# Altium schematic sheet Schematic.SchDoc
size 635 x 381 mm; SheetNumber: 1; SheetTotal: 1
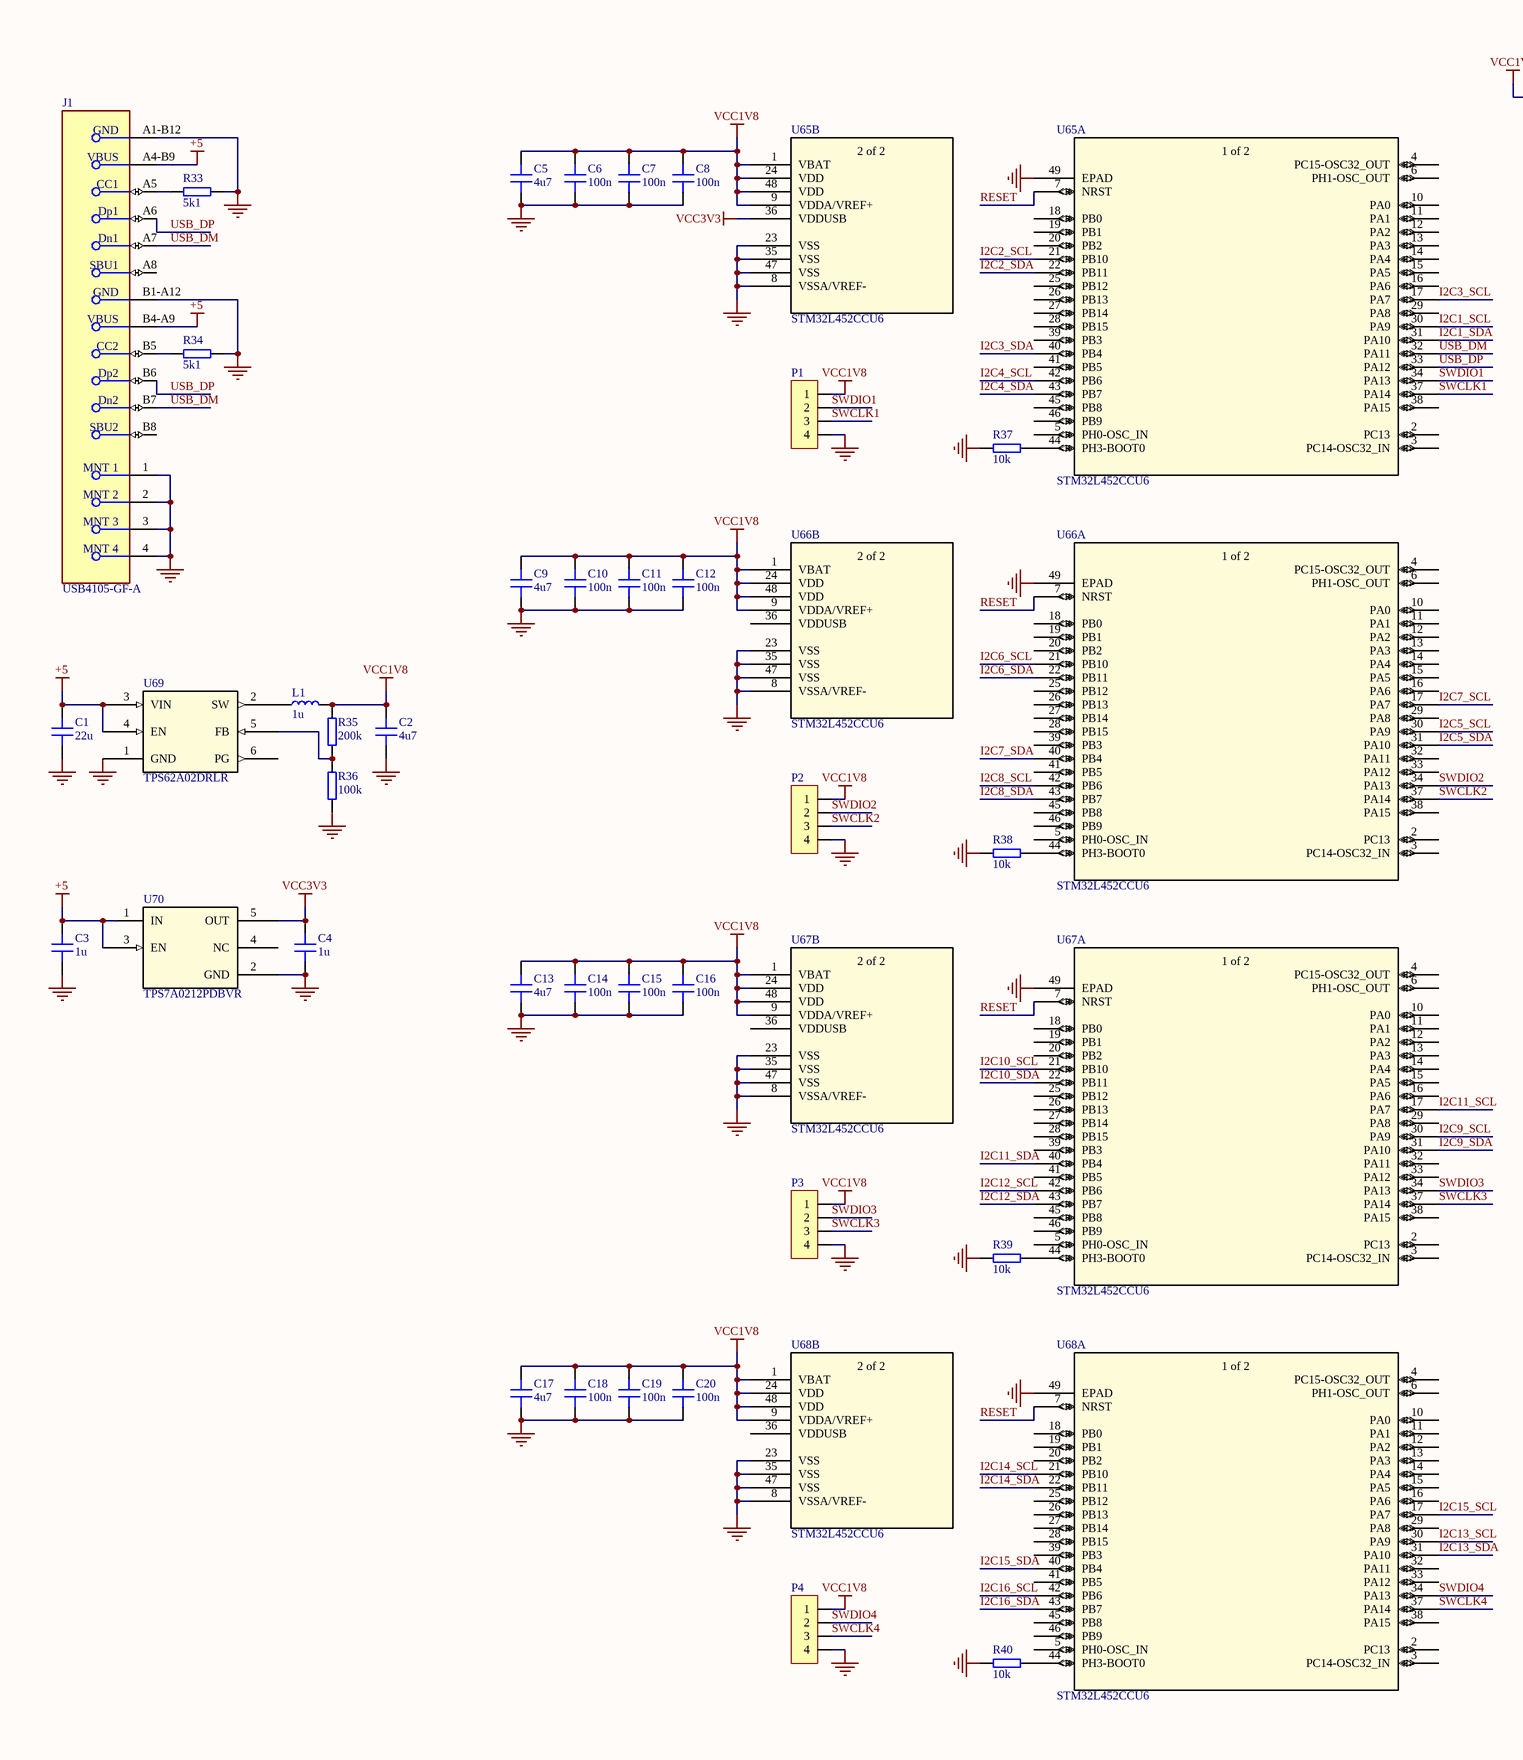
[diagram p0: Schematic.SchDoc, left]
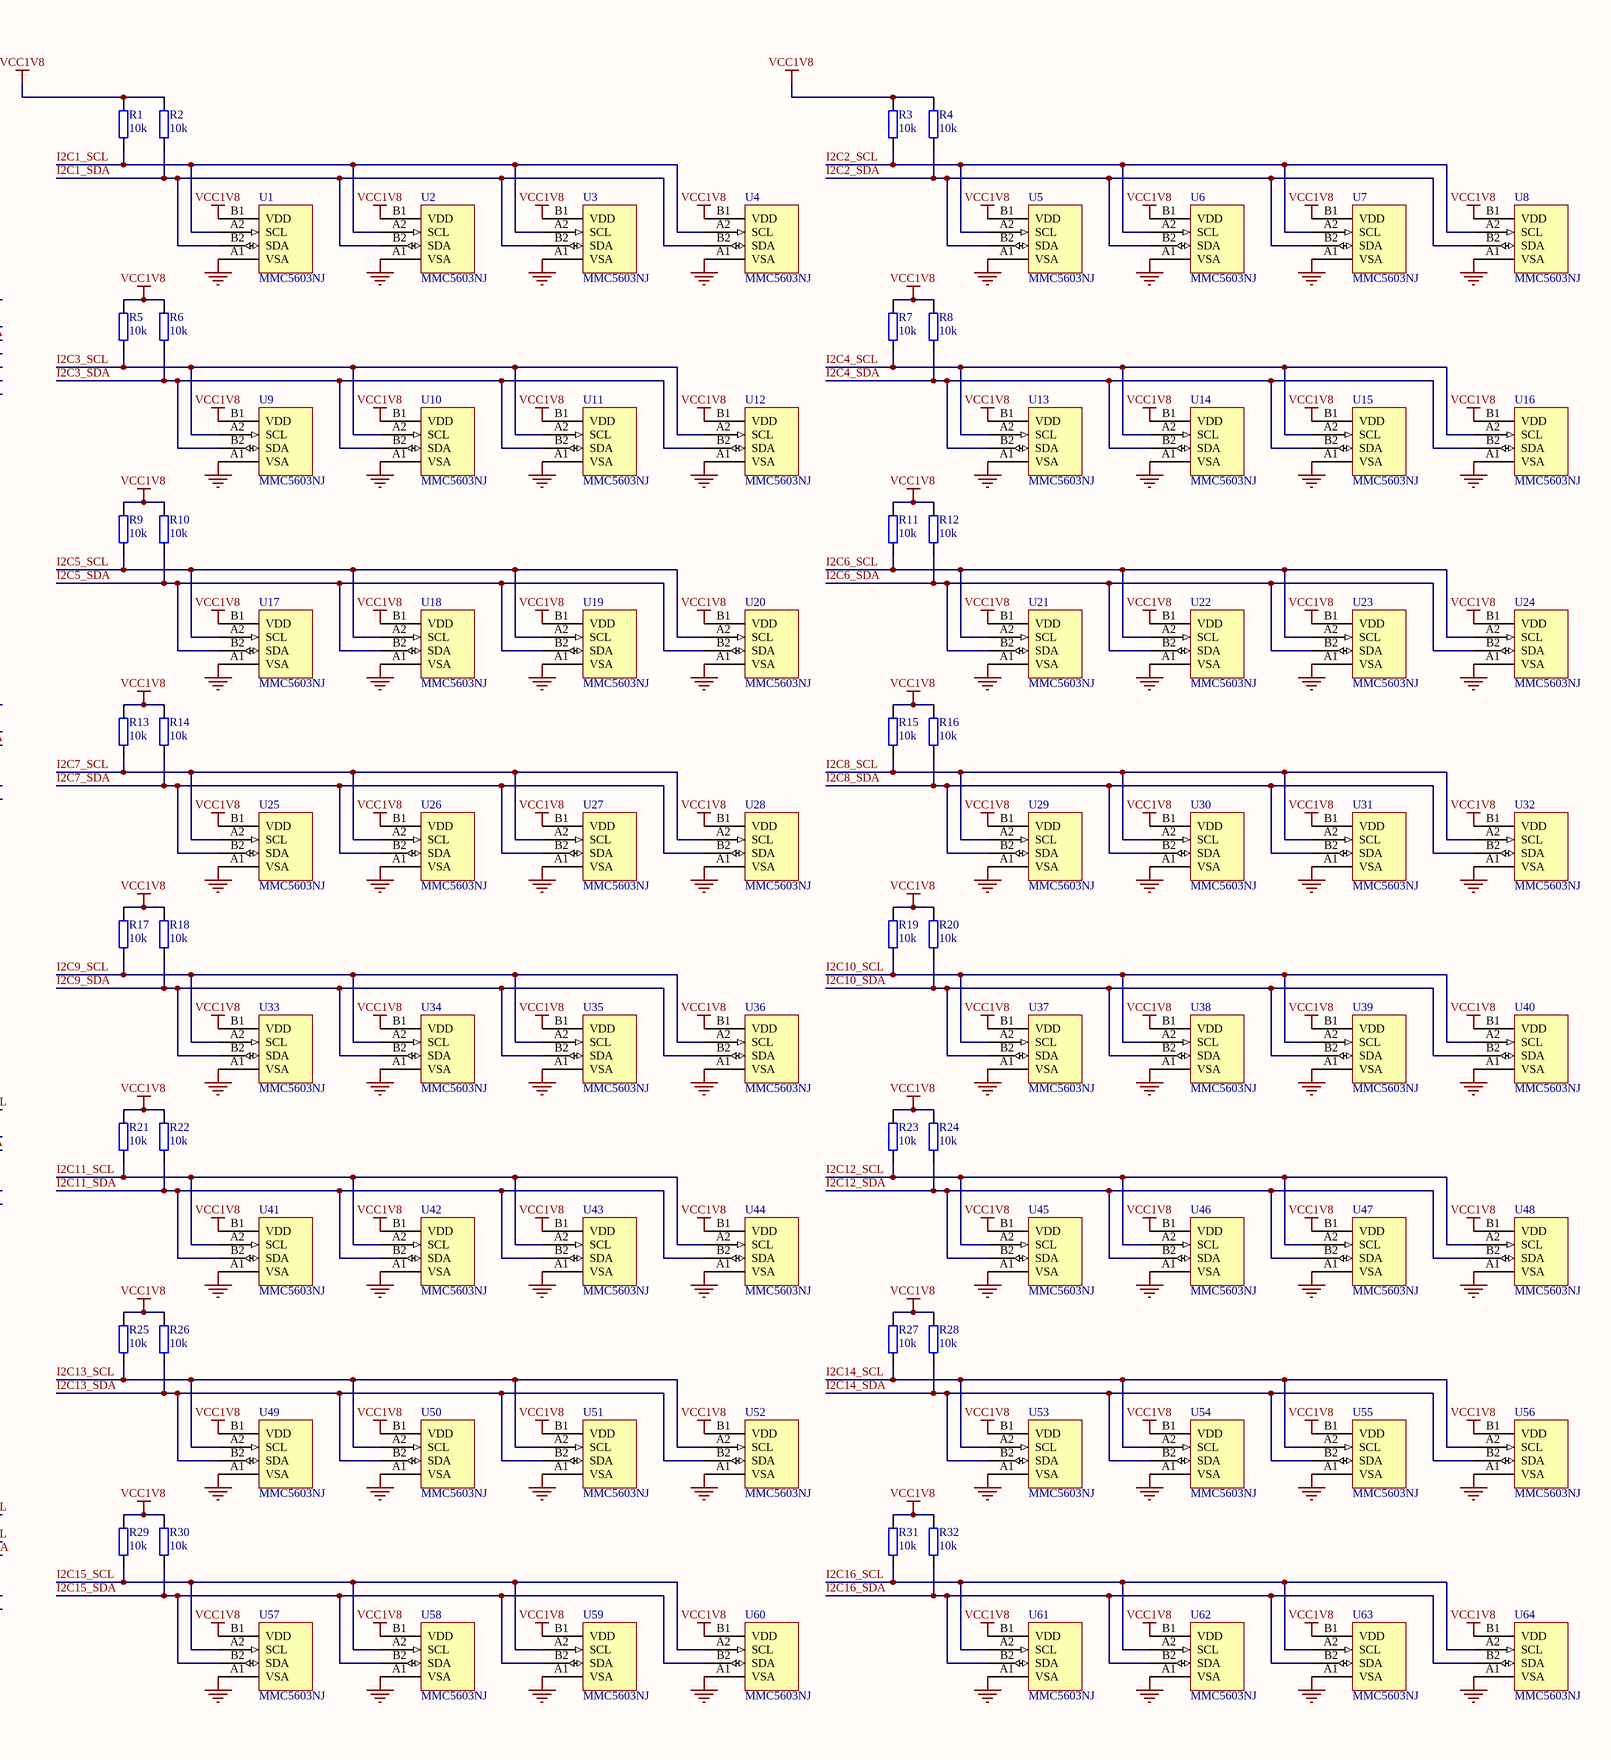
[diagram p1: Schematic.SchDoc, right]

## Parts
C1  22u  [CAP_0603]
C2  4u7  [CAP_0603]
C3  1u  [CAP_0603]
C4  1u  [CAP_0603]
C5  4u7  [CAP_0603]
C6  100n  [CAP_0402]
C7  100n  [CAP_0402]
C8  100n  [CAP_0402]
C9  4u7  [CAP_0603]
C10  100n  [CAP_0402]
C11  100n  [CAP_0402]
C12  100n  [CAP_0402]
C13  4u7  [CAP_0603]
C14  100n  [CAP_0402]
C15  100n  [CAP_0402]
C16  100n  [CAP_0402]
C17  4u7  [CAP_0603]
C18  100n  [CAP_0402]
C19  100n  [CAP_0402]
C20  100n  [CAP_0402]
J1  USB4105-GF-A  [FP-USB4105-GF-A-MFG]
L1  1u  [IND_0603]
P1  PIN_1.27x4  [PIN_1.27x4]  (value not drawn)
P2  PIN_1.27x4  [PIN_1.27x4]  (value not drawn)
P3  PIN_1.27x4  [PIN_1.27x4]  (value not drawn)
P4  PIN_1.27x4  [PIN_1.27x4]  (value not drawn)
R1  10k  [RES_0402_RF]
R2  10k  [RES_0402_RF]
R3  10k  [RES_0402_RF]
R4  10k  [RES_0402_RF]
R5  10k  [RES_0402_RF]
R6  10k  [RES_0402_RF]
R7  10k  [RES_0402_RF]
R8  10k  [RES_0402_RF]
R9  10k  [RES_0402_RF]
R10  10k  [RES_0402_RF]
R11  10k  [RES_0402_RF]
R12  10k  [RES_0402_RF]
R13  10k  [RES_0402_RF]
R14  10k  [RES_0402_RF]
R15  10k  [RES_0402_RF]
R16  10k  [RES_0402_RF]
R17  10k  [RES_0402_RF]
R18  10k  [RES_0402_RF]
R19  10k  [RES_0402_RF]
R20  10k  [RES_0402_RF]
R21  10k  [RES_0402_RF]
R22  10k  [RES_0402_RF]
R23  10k  [RES_0402_RF]
R24  10k  [RES_0402_RF]
R25  10k  [RES_0402_RF]
R26  10k  [RES_0402_RF]
R27  10k  [RES_0402_RF]
R28  10k  [RES_0402_RF]
R29  10k  [RES_0402_RF]
R30  10k  [RES_0402_RF]
R31  10k  [RES_0402_RF]
R32  10k  [RES_0402_RF]
R33  5k1  [RES_0402_RF]
R34  5k1  [RES_0402_RF]
R35  200k  [RES_0402_RF]
R36  100k  [RES_0402_RF]
R37  10k  [RES_0402_RF]
R38  10k  [RES_0402_RF]
R39  10k  [RES_0402_RF]
R40  10k  [RES_0402_RF]
U1  MMC5603NJ  [WLP4x2]
U2  MMC5603NJ  [WLP4x2]
U3  MMC5603NJ  [WLP4x2]
U4  MMC5603NJ  [WLP4x2]
U5  MMC5603NJ  [WLP4x2]
U6  MMC5603NJ  [WLP4x2]
U7  MMC5603NJ  [WLP4x2]
U8  MMC5603NJ  [WLP4x2]
U9  MMC5603NJ  [WLP4x2]
U10  MMC5603NJ  [WLP4x2]
U11  MMC5603NJ  [WLP4x2]
U12  MMC5603NJ  [WLP4x2]
U13  MMC5603NJ  [WLP4x2]
U14  MMC5603NJ  [WLP4x2]
U15  MMC5603NJ  [WLP4x2]
U16  MMC5603NJ  [WLP4x2]
U17  MMC5603NJ  [WLP4x2]
U18  MMC5603NJ  [WLP4x2]
U19  MMC5603NJ  [WLP4x2]
U20  MMC5603NJ  [WLP4x2]
U21  MMC5603NJ  [WLP4x2]
U22  MMC5603NJ  [WLP4x2]
U23  MMC5603NJ  [WLP4x2]
U24  MMC5603NJ  [WLP4x2]
U25  MMC5603NJ  [WLP4x2]
U26  MMC5603NJ  [WLP4x2]
U27  MMC5603NJ  [WLP4x2]
U28  MMC5603NJ  [WLP4x2]
U29  MMC5603NJ  [WLP4x2]
U30  MMC5603NJ  [WLP4x2]
U31  MMC5603NJ  [WLP4x2]
U32  MMC5603NJ  [WLP4x2]
U33  MMC5603NJ  [WLP4x2]
U34  MMC5603NJ  [WLP4x2]
U35  MMC5603NJ  [WLP4x2]
U36  MMC5603NJ  [WLP4x2]
U37  MMC5603NJ  [WLP4x2]
U38  MMC5603NJ  [WLP4x2]
U39  MMC5603NJ  [WLP4x2]
U40  MMC5603NJ  [WLP4x2]
U41  MMC5603NJ  [WLP4x2]
U42  MMC5603NJ  [WLP4x2]
U43  MMC5603NJ  [WLP4x2]
U44  MMC5603NJ  [WLP4x2]
U45  MMC5603NJ  [WLP4x2]
U46  MMC5603NJ  [WLP4x2]
U47  MMC5603NJ  [WLP4x2]
U48  MMC5603NJ  [WLP4x2]
U49  MMC5603NJ  [WLP4x2]
U50  MMC5603NJ  [WLP4x2]
U51  MMC5603NJ  [WLP4x2]
U52  MMC5603NJ  [WLP4x2]
U53  MMC5603NJ  [WLP4x2]
U54  MMC5603NJ  [WLP4x2]
U55  MMC5603NJ  [WLP4x2]
U56  MMC5603NJ  [WLP4x2]
U57  MMC5603NJ  [WLP4x2]
U58  MMC5603NJ  [WLP4x2]
U59  MMC5603NJ  [WLP4x2]
U60  MMC5603NJ  [WLP4x2]
U61  MMC5603NJ  [WLP4x2]
U62  MMC5603NJ  [WLP4x2]
U63  MMC5603NJ  [WLP4x2]
U64  MMC5603NJ  [WLP4x2]
U65  STM32L452CCU6  [UFQFPN48-7x7mm_STM]  (parts A,B of 2)
U66  STM32L452CCU6  [UFQFPN48-7x7mm_STM]  (parts A,B of 2)
U67  STM32L452CCU6  [UFQFPN48-7x7mm_STM]  (parts A,B of 2)
U68  STM32L452CCU6  [UFQFPN48-7x7mm_STM]  (parts A,B of 2)
U69  TPS62A02DRLR  [SOT-5X3-6_DRL_TEX]
U70  TPS7A0212PDBVR  [SOT23_DBV_TEX]

## Nets
+5: C1.2 C3.2 J1.A4-B9(VBUS) J1.B4-A9(VBUS) U69.3(VIN) U69.4(EN) U70.1(IN) U70.3(EN)
GND: C1.1 C2.1 C3.1 C4.1 C5.1 C6.1 C7.1 C8.1 C9.1 C10.1 C11.1 C12.1 C13.1 C14.1 C15.1 C16.1 C17.1 C18.1 C19.1 C20.1 J1.1(MNT_1) J1.2(MNT_2) J1.3(MNT_3) J1.4(MNT_4) J1.A1-B12(GND) J1.B1-A12(GND) P1.4 P2.4 P3.4 P4.4 R33.1 R34.1 R36.2 R37.2 R38.2 R39.2 R40.2 U1.A1(VSA) U2.A1(VSA) U3.A1(VSA) U4.A1(VSA) U5.A1(VSA) U6.A1(VSA) U7.A1(VSA) U8.A1(VSA) U9.A1(VSA) U10.A1(VSA) U11.A1(VSA) U12.A1(VSA) U13.A1(VSA) U14.A1(VSA) U15.A1(VSA) U16.A1(VSA) U17.A1(VSA) U18.A1(VSA) U19.A1(VSA) U20.A1(VSA) U21.A1(VSA) U22.A1(VSA) U23.A1(VSA) U24.A1(VSA) U25.A1(VSA) U26.A1(VSA) U27.A1(VSA) U28.A1(VSA) U29.A1(VSA) U30.A1(VSA) U31.A1(VSA) U32.A1(VSA) U33.A1(VSA) U34.A1(VSA) U35.A1(VSA) U36.A1(VSA) U37.A1(VSA) U38.A1(VSA) U39.A1(VSA) U40.A1(VSA) U41.A1(VSA) U42.A1(VSA) U43.A1(VSA) U44.A1(VSA) U45.A1(VSA) U46.A1(VSA) U47.A1(VSA) U48.A1(VSA) U49.A1(VSA) U50.A1(VSA) U51.A1(VSA) U52.A1(VSA) U53.A1(VSA) U54.A1(VSA) U55.A1(VSA) U56.A1(VSA) U57.A1(VSA) U58.A1(VSA) U59.A1(VSA) U60.A1(VSA) U61.A1(VSA) U62.A1(VSA) U63.A1(VSA) U64.A1(VSA) U65.8(VSSA/VREF-) U65.23(VSS) U65.35(VSS) U65.47(VSS) U65.49(EPAD) U66.8(VSSA/VREF-) U66.23(VSS) U66.35(VSS) U66.47(VSS) U66.49(EPAD) U67.8(VSSA/VREF-) U67.23(VSS) U67.35(VSS) U67.47(VSS) U67.49(EPAD) U68.8(VSSA/VREF-) U68.23(VSS) U68.35(VSS) U68.47(VSS) U68.49(EPAD) U69.1(GND) U70.2(GND)
VCC1V8: C2.2 C5.2 C6.2 C7.2 C8.2 C9.2 C10.2 C11.2 C12.2 C13.2 C14.2 C15.2 C16.2 C17.2 C18.2 C19.2 C20.2 L1.2 P1.1 P2.1 P3.1 P4.1 R1.2 R2.2 R3.2 R4.2 R5.2 R6.2 R7.2 R8.2 R9.2 R10.2 R11.2 R12.2 R13.2 R14.2 R15.2 R16.2 R17.2 R18.2 R19.2 R20.2 R21.2 R22.2 R23.2 R24.2 R25.2 R26.2 R27.2 R28.2 R29.2 R30.2 R31.2 R32.2 R35.1 U1.B1(VDD) U2.B1(VDD) U3.B1(VDD) U4.B1(VDD) U5.B1(VDD) U6.B1(VDD) U7.B1(VDD) U8.B1(VDD) U9.B1(VDD) U10.B1(VDD) U11.B1(VDD) U12.B1(VDD) U13.B1(VDD) U14.B1(VDD) U15.B1(VDD) U16.B1(VDD) U17.B1(VDD) U18.B1(VDD) U19.B1(VDD) U20.B1(VDD) U21.B1(VDD) U22.B1(VDD) U23.B1(VDD) U24.B1(VDD) U25.B1(VDD) U26.B1(VDD) U27.B1(VDD) U28.B1(VDD) U29.B1(VDD) U30.B1(VDD) U31.B1(VDD) U32.B1(VDD) U33.B1(VDD) U34.B1(VDD) U35.B1(VDD) U36.B1(VDD) U37.B1(VDD) U38.B1(VDD) U39.B1(VDD) U40.B1(VDD) U41.B1(VDD) U42.B1(VDD) U43.B1(VDD) U44.B1(VDD) U45.B1(VDD) U46.B1(VDD) U47.B1(VDD) U48.B1(VDD) U49.B1(VDD) U50.B1(VDD) U51.B1(VDD) U52.B1(VDD) U53.B1(VDD) U54.B1(VDD) U55.B1(VDD) U56.B1(VDD) U57.B1(VDD) U58.B1(VDD) U59.B1(VDD) U60.B1(VDD) U61.B1(VDD) U62.B1(VDD) U63.B1(VDD) U64.B1(VDD) U65.1(VBAT) U65.9(VDDA/VREF+) U65.24(VDD) U65.48(VDD) U66.1(VBAT) U66.9(VDDA/VREF+) U66.24(VDD) U66.48(VDD) U67.1(VBAT) U67.9(VDDA/VREF+) U67.24(VDD) U67.48(VDD) U68.1(VBAT) U68.9(VDDA/VREF+) U68.24(VDD) U68.48(VDD)
VCC3V3: C4.2 U65.36(VDDUSB) U70.5(OUT)
I2C1_SCL: R1.1 U1.A2(SCL) U2.A2(SCL) U3.A2(SCL) U4.A2(SCL) U65.30(PA9)
I2C1_SDA: R2.1 U1.B2(SDA) U2.B2(SDA) U3.B2(SDA) U4.B2(SDA) U65.31(PA10)
I2C2_SCL: R3.1 U5.A2(SCL) U6.A2(SCL) U7.A2(SCL) U8.A2(SCL) U65.21(PB10)
I2C2_SDA: R4.1 U5.B2(SDA) U6.B2(SDA) U7.B2(SDA) U8.B2(SDA) U65.22(PB11)
I2C3_SCL: R5.1 U9.A2(SCL) U10.A2(SCL) U11.A2(SCL) U12.A2(SCL) U65.17(PA7)
I2C3_SDA: R6.1 U9.B2(SDA) U10.B2(SDA) U11.B2(SDA) U12.B2(SDA) U65.40(PB4)
I2C4_SCL: R7.1 U13.A2(SCL) U14.A2(SCL) U15.A2(SCL) U16.A2(SCL) U65.42(PB6)
I2C4_SDA: R8.1 U13.B2(SDA) U14.B2(SDA) U15.B2(SDA) U16.B2(SDA) U65.43(PB7)
I2C5_SCL: R9.1 U17.A2(SCL) U18.A2(SCL) U19.A2(SCL) U20.A2(SCL) U66.30(PA9)
I2C5_SDA: R10.1 U17.B2(SDA) U18.B2(SDA) U19.B2(SDA) U20.B2(SDA) U66.31(PA10)
I2C6_SCL: R11.1 U21.A2(SCL) U22.A2(SCL) U23.A2(SCL) U24.A2(SCL) U66.21(PB10)
I2C6_SDA: R12.1 U21.B2(SDA) U22.B2(SDA) U23.B2(SDA) U24.B2(SDA) U66.22(PB11)
I2C7_SCL: R13.1 U25.A2(SCL) U26.A2(SCL) U27.A2(SCL) U28.A2(SCL) U66.17(PA7)
I2C7_SDA: R14.1 U25.B2(SDA) U26.B2(SDA) U27.B2(SDA) U28.B2(SDA) U66.40(PB4)
I2C8_SCL: R15.1 U29.A2(SCL) U30.A2(SCL) U31.A2(SCL) U32.A2(SCL) U66.42(PB6)
I2C8_SDA: R16.1 U29.B2(SDA) U30.B2(SDA) U31.B2(SDA) U32.B2(SDA) U66.43(PB7)
I2C9_SCL: R17.1 U33.A2(SCL) U34.A2(SCL) U35.A2(SCL) U36.A2(SCL) U67.30(PA9)
I2C9_SDA: R18.1 U33.B2(SDA) U34.B2(SDA) U35.B2(SDA) U36.B2(SDA) U67.31(PA10)
I2C10_SCL: R19.1 U37.A2(SCL) U38.A2(SCL) U39.A2(SCL) U40.A2(SCL) U67.21(PB10)
I2C10_SDA: R20.1 U37.B2(SDA) U38.B2(SDA) U39.B2(SDA) U40.B2(SDA) U67.22(PB11)
I2C11_SCL: R21.1 U41.A2(SCL) U42.A2(SCL) U43.A2(SCL) U44.A2(SCL) U67.17(PA7)
I2C11_SDA: R22.1 U41.B2(SDA) U42.B2(SDA) U43.B2(SDA) U44.B2(SDA) U67.40(PB4)
I2C12_SCL: R23.1 U45.A2(SCL) U46.A2(SCL) U47.A2(SCL) U48.A2(SCL) U67.42(PB6)
I2C12_SDA: R24.1 U45.B2(SDA) U46.B2(SDA) U47.B2(SDA) U48.B2(SDA) U67.43(PB7)
I2C13_SCL: R25.1 U49.A2(SCL) U50.A2(SCL) U51.A2(SCL) U52.A2(SCL) U68.30(PA9)
I2C13_SDA: R26.1 U49.B2(SDA) U50.B2(SDA) U51.B2(SDA) U52.B2(SDA) U68.31(PA10)
I2C14_SCL: R27.1 U53.A2(SCL) U54.A2(SCL) U55.A2(SCL) U56.A2(SCL) U68.21(PB10)
I2C14_SDA: R28.1 U53.B2(SDA) U54.B2(SDA) U55.B2(SDA) U56.B2(SDA) U68.22(PB11)
I2C15_SCL: R29.1 U57.A2(SCL) U58.A2(SCL) U59.A2(SCL) U60.A2(SCL) U68.17(PA7)
I2C15_SDA: R30.1 U57.B2(SDA) U58.B2(SDA) U59.B2(SDA) U60.B2(SDA) U68.40(PB4)
I2C16_SCL: R31.1 U61.A2(SCL) U62.A2(SCL) U63.A2(SCL) U64.A2(SCL) U68.42(PB6)
I2C16_SDA: R32.1 U61.B2(SDA) U62.B2(SDA) U63.B2(SDA) U64.B2(SDA) U68.43(PB7)
RESET: U65.7(NRST) U66.7(NRST) U67.7(NRST) U68.7(NRST)
SWCLK1: P1.3 U65.37(PA14)
SWCLK2: P2.3 U66.37(PA14)
SWCLK3: P3.3 U67.37(PA14)
SWCLK4: P4.3 U68.37(PA14)
SWDIO1: P1.2 U65.34(PA13)
SWDIO2: P2.2 U66.34(PA13)
SWDIO3: P3.2 U67.34(PA13)
SWDIO4: P4.2 U68.34(PA13)
USB_DM: J1.A7(Dn1) J1.B7(Dn2) U65.32(PA11)
USB_DP: J1.A6(Dp1) J1.B6(Dp2) U65.33(PA12)
NetJ1_A5: J1.A5(CC1) R33.2
NetJ1_B5: J1.B5(CC2) R34.2
NetL1_1: L1.1 U69.2(SW)
NetR35_2: R35.2 R36.1 U69.5(FB)
NetR37_1: R37.1 U65.44(PH3-BOOT0)
NetR38_1: R38.1 U66.44(PH3-BOOT0)
NetR39_1: R39.1 U67.44(PH3-BOOT0)
NetR40_1: R40.1 U68.44(PH3-BOOT0)

Not connected (* = marked no-connect by the designer): J1 A8(SBU1) B8(SBU2); U65 2(PC13) 3(PC14-OSC32_IN) 4(PC15-OSC32_OUT) 5(PH0-OSC_IN) 6(PH1-OSC_OUT) 10(PA0) 11(PA1) 12(PA2) 13(PA3) 14(PA4) 15(PA5) 16(PA6) 18(PB0) 19(PB1) 20(PB2) 25(PB12) 26(PB13) 27(PB14) 28(PB15) 29(PA8) 38(PA15) 39(PB3) 41(PB5) 45(PB8) 46(PB9); U66 2(PC13) 3(PC14-OSC32_IN) 4(PC15-OSC32_OUT) 5(PH0-OSC_IN) 6(PH1-OSC_OUT) 10(PA0) 11(PA1) 12(PA2) 13(PA3) 14(PA4) 15(PA5) 16(PA6) 18(PB0) 19(PB1) 20(PB2) 25(PB12) 26(PB13) 27(PB14) 28(PB15) 29(PA8) 32(PA11) 33(PA12) 36(VDDUSB) 38(PA15) 39(PB3) 41(PB5) 45(PB8) 46(PB9); U67 2(PC13) 3(PC14-OSC32_IN) 4(PC15-OSC32_OUT) 5(PH0-OSC_IN) 6(PH1-OSC_OUT) 10(PA0) 11(PA1) 12(PA2) 13(PA3) 14(PA4) 15(PA5) 16(PA6) 18(PB0) 19(PB1) 20(PB2) 25(PB12) 26(PB13) 27(PB14) 28(PB15) 29(PA8) 32(PA11) 33(PA12) 36(VDDUSB) 38(PA15) 39(PB3) 41(PB5) 45(PB8) 46(PB9); U68 2(PC13) 3(PC14-OSC32_IN) 4(PC15-OSC32_OUT) 5(PH0-OSC_IN) 6(PH1-OSC_OUT) 10(PA0) 11(PA1) 12(PA2) 13(PA3) 14(PA4) 15(PA5) 16(PA6) 18(PB0) 19(PB1) 20(PB2) 25(PB12) 26(PB13) 27(PB14) 28(PB15) 29(PA8) 32(PA11) 33(PA12) 36(VDDUSB) 38(PA15) 39(PB3) 41(PB5) 45(PB8) 46(PB9); U69 6(PG); U70 4(NC)

## Notes on the sheet
- (in symbol STM32L452CCU6, part A) 1 of 2
- (in symbol STM32L452CCU6, part B) 2 of 2

## Library data of the parts
C1-C5 C9 C13 C17 = CAP_0603: Capacitor SMD 0603; Voltage: 50V
  C1: Capacitance: 22u
  C2 C5 C9 C13 C17: Capacitance: 4u7
  C3 C4: Capacitance: 1u
C6-C8 C10-C12 C14-C16 C18-C20 = CAP_0402: Capacitor SMD 0402; Voltage: 50V; Capacitance: 100n
J1 = CMP-245163-000001-1: CONN RCPT USB2.0 TYPEC 5A; Manufacturer: GCT; Voltage Rating: 20V; Is Female: yes; Current Rating: 5/6.25/1.25/0.25A; Number Of Contacts: 16; Conn Orientation: Right Angle; Device Class L1: Connectors; Category: Conn; Lead Free: Yes; RoHS: TRUE; Temperature Range High: +85°C; Digikey Description: CONN RCPT USB2.0 TYPEC 5A; Device Class L3: unset; ComponentLink2Description: Datasheet; Manufacturer Part Number: USB4105-GF-A; Package: 0; Usb Standard: USB 2.0; Device Class L2: USB Connectors; Automotive: No; Temperature Range Low: -40°C; Height: 3.46mm; Temperature: -40°C to +85°C; Contact Material: Gold,Nickel; ComponentLink2URL: https://gct.co/files/drawings/usb4105.pdf; Octopart: https://octopart.com/usb4105-gf-a-gct-106627878
L1 = IND_0603: Inductor SMD 0603; Inductance: 1u
R1-R40 = RES_0402: Resistor SMD 0402
  R1-R32 R37-R40: Resistance: 10k
  R33 R34: Resistance: 5k1
  R35: Resistance: 200k
  R36: Resistance: 100k
U1-U64 = MMC5603NJ: 3-AXIS Amr Magnetic Sensor; Manufacturer: Memsic; Supplier 1: Digi-Key; Manufacturer Part Number: MMC5603NJ; RoHS: Yes; Stock 1: 9156; Pricing 1: 1=1.12000, 5=1.06600, 10=0.92800, 25=0.81520, 50=0.67720, 100=0.57680, 500=0.50160, 1000=0.43890, 5000=0.38874 (USD); Supplier Part Number 1: 1267-MMC5603NJCT-ND
U65-U68 = STM32L452CCU6: No Description Available; Mfr_Name: STMicroelectronics; Copyright: Copyright (C) 2023 Ultra Librarian. All rights reserved.; Manufacturer_Part_Number: STM32L452CCU6; RefDes: RefDes; Type: DEV
U69 = TPS62A02DRLR: No Description Available; Mfr_Name: Texas Instruments; Copyright: Copyright (C) 2023 Ultra Librarian. All rights reserved.; Manufacturer_Part_Number: TPS62A02DRLR; RefDes: RefDes; Type: DEV
U70 = TPS7A0212PDBVR: No Description Available; Mfr_Name: Texas Instruments; Copyright: Copyright (C) 2023 Ultra Librarian. All rights reserved.; Manufacturer_Part_Number: TPS7A0212PDBVR; RefDes: RefDes; Type: DEV